# Altium project 采集卡第一版.PrjPCB (part 2 of 2)
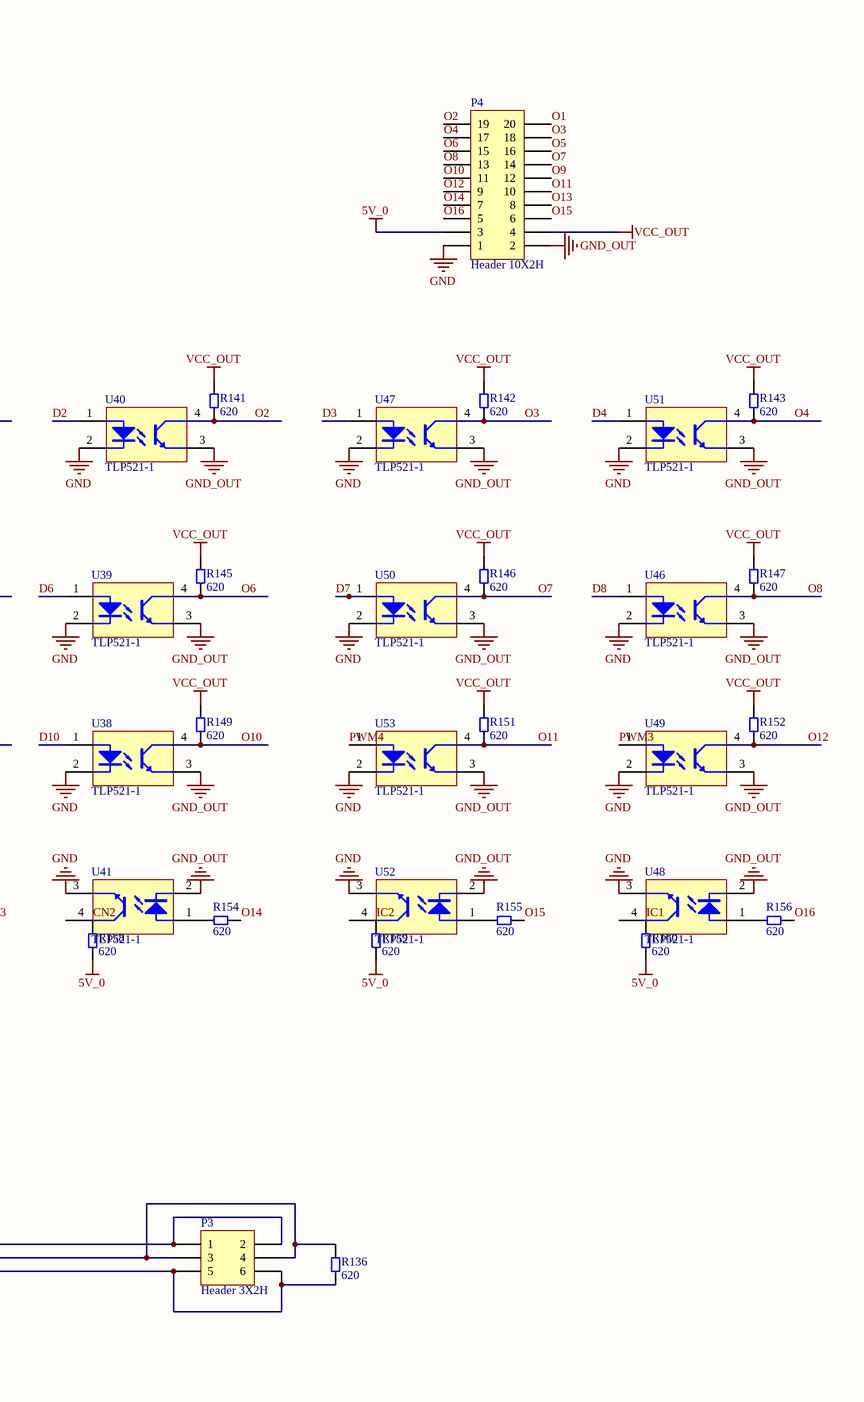
[diagram p10: 数字部分.SchDoc, right]

## Nets that join several sheets
5V_0: 模拟量输入输出 (6 pins), 电池电压检测 (C175.2 U10.1), 电源 (9 pins), 数字部分 (23 pins)
+5V_1: 电池电压检测 (13 pins), U_电池电压检测/DI1 (C134_DI1.2 U17_DI1.7), U_电池电压检测/DI2 (C134_DI2.2 U17_DI2.7), U_电池电压检测/DI3 (C134_DI3.2 U17_DI3.7), U_电池电压检测/DI4 (C134_DI4.2 U17_DI4.7), U_电池电压检测/DI5 (C134_DI5.2 U17_DI5.7), U_电池电压检测/DI6 (C134_DI6.2 U17_DI6.7), U_电池电压检测/DI7 (C134_DI7.2 U17_DI7.7), U_电池电压检测/DI8 (C134_DI8.2 U17_DI8.7), 电源 (C64.1 C66.1 U13.4 U13.5)
+5V_2: 模拟量输入输出 (26 pins), 电源 (R181.2)
+6V_2: 模拟量输入输出 (5 pins), 电源 (C4.1 C99.2 R180.1)
-5V_1: U_电池电压检测/DI1 (C135_DI1.2 U17_DI1.2), U_电池电压检测/DI2 (C135_DI2.2 U17_DI2.2), U_电池电压检测/DI3 (C135_DI3.2 U17_DI3.2), U_电池电压检测/DI4 (C135_DI4.2 U17_DI4.2), U_电池电压检测/DI5 (C135_DI5.2 U17_DI5.2), U_电池电压检测/DI6 (C135_DI6.2 U17_DI6.2), U_电池电压检测/DI7 (C135_DI7.2 U17_DI7.2), U_电池电压检测/DI8 (C135_DI8.2 U17_DI8.2), 电源 (C39.1 C72.1 U14.5)
AGND_1: 电池电压检测 (53 pins), U_电池电压检测/DI1 (8 pins), U_电池电压检测/DI2 (8 pins), U_电池电压检测/DI3 (8 pins), U_电池电压检测/DI4 (8 pins), U_电池电压检测/DI5 (8 pins), U_电池电压检测/DI6 (8 pins), U_电池电压检测/DI7 (8 pins), U_电池电压检测/DI8 (8 pins), 电源 (9 pins)
AGND_2: 模拟量输入输出 (95 pins), 电源 (5 pins)
DGND_1: 电池电压检测 (8 pins), 电源 (9 pins)
DGND_2: 模拟量输入输出 (8 pins), 电源 (C4.2 C99.1 C206.2)
DVCC_1: 电池电压检测 (9 pins), 电源 (C136.1)
DVCC_2: 模拟量输入输出 (14 pins), 电源 (5 pins)
GND: 模拟量输入输出 (7 pins), 电池电压检测 (C175.1 U10.8), 电源 (40 pins), 数字部分 (77 pins)
USB_5V: 电源 (D9.2 P5.3), 数字部分 (5 pins)
VCC_1: 电池电压检测 (C2.1 U10.16), 电源 (C69.1 U12.18)
A0: 电池电压检测 (8 pins), 电源 (A20.4)
A1: 电池电压检测 (8 pins), 电源 (A20.6)
CH1: 电池电压检测 (U8.8), U_电池电压检测/DI1 (C20_DI1.1 C21_DI1.1 R17_DI1.2)
CH2: 电池电压检测 (U2.8), U_电池电压检测/DI2 (C20_DI2.1 C21_DI2.1 R17_DI2.2)
CH3: 电池电压检测 (U3.8), U_电池电压检测/DI3 (C20_DI3.1 C21_DI3.1 R17_DI3.2)
CH4: 电池电压检测 (U7.8), U_电池电压检测/DI4 (C20_DI4.1 C21_DI4.1 R17_DI4.2)
CH5: 电池电压检测 (U4.8), U_电池电压检测/DI5 (C20_DI5.1 C21_DI5.1 R17_DI5.2)
CH6: 电池电压检测 (U6.8), U_电池电压检测/DI6 (C20_DI6.1 C21_DI6.1 R17_DI6.2)
CH7: 电池电压检测 (U5.8), U_电池电压检测/DI7 (C20_DI7.1 C21_DI7.1 R17_DI7.2)
CH8: 电池电压检测 (U9.8), U_电池电压检测/DI8 (C20_DI8.1 C21_DI8.1 R17_DI8.2)
CL1: 电池电压检测 (U8.9), U_电池电压检测/DI1 (C20_DI1.2 C21_DI1.2 R15_DI1.2)
CL2: 电池电压检测 (U2.9), U_电池电压检测/DI2 (C20_DI2.2 C21_DI2.2 R15_DI2.2)
CL3: 电池电压检测 (U3.9), U_电池电压检测/DI3 (C20_DI3.2 C21_DI3.2 R15_DI3.2)
CL4: 电池电压检测 (U7.9), U_电池电压检测/DI4 (C20_DI4.2 C21_DI4.2 R15_DI4.2)
CL5: 电池电压检测 (U4.9), U_电池电压检测/DI5 (C20_DI5.2 C21_DI5.2 R15_DI5.2)
CL6: 电池电压检测 (U6.9), U_电池电压检测/DI6 (C20_DI6.2 C21_DI6.2 R15_DI6.2)
CL7: 电池电压检测 (U5.9), U_电池电压检测/DI7 (C20_DI7.2 C21_DI7.2 R15_DI7.2)
CL8: 电池电压检测 (U9.9), U_电池电压检测/DI8 (C20_DI8.2 C21_DI8.2 R15_DI8.2)
CONVA: 电池电压检测 (U1.9 U1.10), 电源 (A20.8)
DOUT1: 电池电压检测 (R125.2), 数字部分 (U19.59)
DOUT2: 电源 (A3.1), 数字部分 (U19.43)
DOUT3: 电源 (A3.3), 数字部分 (U19.70 U34.1 U34.4 U35.2)
DOUT4: 电源 (A3.5), 数字部分 (U19.71 U35.1 U35.4)
DOUT5: 模拟量输入输出 (A4.5), 数字部分 (U19.21)
EN: 电池电压检测 (8 pins), 电源 (A20.2)
INT1: 电池电压检测 (R128.2), 数字部分 (U19.44)
INT2: 模拟量输入输出 (A4.7), 数字部分 (R182.2 U19.20)
OUT1: 电池电压检测 (U1.63), U_电池电压检测/DI1 (C28_DI1.2 R20_DI1.1)
OUT2: 电池电压检测 (U1.61), U_电池电压检测/DI2 (C28_DI2.2 R20_DI2.1)
OUT3: 电池电压检测 (U1.59), U_电池电压检测/DI3 (C28_DI3.2 R20_DI3.1)
OUT4: 电池电压检测 (U1.57), U_电池电压检测/DI4 (C28_DI4.2 R20_DI4.1)
OUT5: 电池电压检测 (U1.55), U_电池电压检测/DI5 (C28_DI5.2 R20_DI5.1)
OUT6: 电池电压检测 (U1.53), U_电池电压检测/DI6 (C28_DI6.2 R20_DI6.1)
OUT7: 电池电压检测 (U1.51), U_电池电压检测/DI7 (C28_DI7.2 R20_DI7.1)
OUT8: 电池电压检测 (U1.49), U_电池电压检测/DI8 (C28_DI8.2 R20_DI8.1)
PWM1: 电源 (A3.7), 数字部分 (U36.4)
PWM2: 模拟量输入输出 (A4.3), 数字部分 (U19.76)
SPI1CS: 电池电压检测 (R127.2), 数字部分 (U19.58)
SPI1DO: 电池电压检测 (R129.2), 数字部分 (U19.52)
SPI1SCK: 电池电压检测 (R126.2), 数字部分 (U19.48)
SPI2CS1: 模拟量输入输出 (R117.2), 数字部分 (U19.7)
SPI2CS2: 模拟量输入输出 (R163.2), 数字部分 (U19.6)
SPI2DI: 模拟量输入输出 (R165.2), 数字部分 (U19.12)
SPI2DO: 模拟量输入输出 (R167.2), 数字部分 (U19.11)
SPI2SCK: 模拟量输入输出 (R23.2), 数字部分 (U19.10)